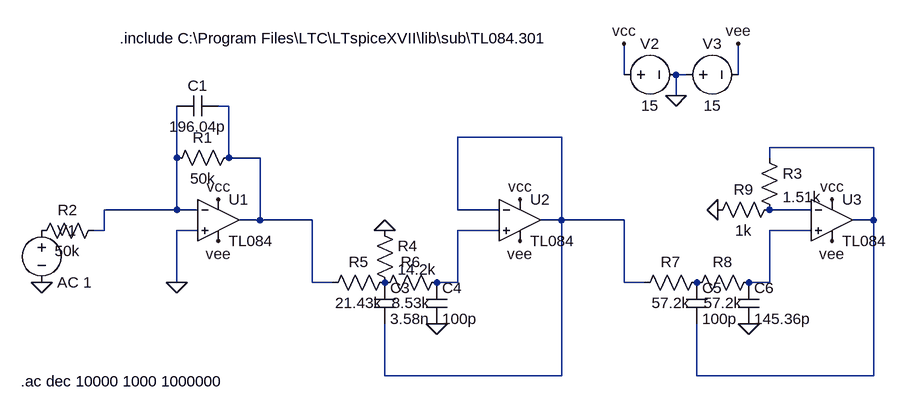
[diagram p0: schematic legendre.asc]
legendre.asc, the LTspice schematic file:
Version 4
SHEET 1 948 680
WIRE 464 -208 464 -256
WIRE 560 -208 544 -208
WIRE 640 -208 640 -256
WIRE 544 -176 544 -208
WIRE -144 -160 -160 -160
WIRE 368 -112 208 -112
WIRE 848 -96 688 -96
WIRE -224 -80 -224 -160
WIRE -144 -80 -144 -160
WIRE -96 -80 -144 -80
WIRE 688 -80 688 -96
WIRE -224 0 -224 -80
WIRE -224 0 -336 0
WIRE -192 0 -224 0
WIRE 208 0 208 -112
WIRE 272 0 208 0
WIRE 752 0 688 0
WIRE -96 16 -96 -80
WIRE -96 16 -128 16
WIRE -16 16 -96 16
WIRE 368 16 368 -112
WIRE 368 16 336 16
WIRE 464 16 368 16
WIRE 848 16 848 -96
WIRE 848 16 816 16
WIRE -336 32 -336 0
WIRE -336 32 -352 32
WIRE -192 32 -224 32
WIRE 272 32 208 32
WIRE 752 32 688 32
WIRE -224 112 -224 32
WIRE -16 112 -16 16
WIRE 16 112 -16 112
WIRE 208 112 208 32
WIRE 208 112 176 112
WIRE 464 112 464 16
WIRE 496 112 464 112
WIRE 688 112 688 32
WIRE 688 112 656 112
WIRE 96 256 96 176
WIRE 368 256 368 16
WIRE 368 256 96 256
WIRE 576 256 576 176
WIRE 848 256 848 16
WIRE 848 256 576 256
FLAG 176 176 0
FLAG 656 176 0
FLAG -224 112 0
FLAG -432 112 0
FLAG 96 32 0
FLAG 608 0 0
FLAG 464 -256 vcc
FLAG 640 -256 vee
FLAG 544 -176 0
FLAG -160 -16 vcc
FLAG 304 -16 vcc
FLAG 784 -16 vcc
FLAG 784 48 vee
FLAG 304 48 vee
FLAG -160 48 vee
SYMBOL res 112 96 R90
WINDOW 0 0 56 VBottom 2
WINDOW 3 32 56 VTop 2
SYMATTR InstName R5
SYMATTR Value 21.43k
SYMBOL cap 80 112 R0
SYMATTR InstName C3
SYMATTR Value 3.58n
SYMBOL res 192 96 R90
WINDOW 0 0 56 VBottom 2
WINDOW 3 32 56 VTop 2
SYMATTR InstName R6
SYMATTR Value 8.53k
SYMBOL cap 160 112 R0
SYMATTR InstName C4
SYMATTR Value 100p
SYMBOL res 592 96 R90
WINDOW 0 0 56 VBottom 2
WINDOW 3 32 56 VTop 2
SYMATTR InstName R7
SYMATTR Value 57.2k
SYMBOL cap 560 112 R0
SYMATTR InstName C5
SYMATTR Value 100p
SYMBOL res 672 96 R90
WINDOW 0 0 56 VBottom 2
WINDOW 3 32 56 VTop 2
SYMATTR InstName R8
SYMATTR Value 57.2k
SYMBOL cap 640 112 R0
SYMATTR InstName C6
SYMATTR Value 145.36p
SYMBOL res -128 -96 R90
WINDOW 0 0 56 VBottom 2
WINDOW 3 32 56 VTop 2
SYMATTR InstName R1
SYMATTR Value 50k
SYMBOL cap -160 -176 R90
WINDOW 0 0 32 VBottom 2
WINDOW 3 32 32 VTop 2
SYMATTR InstName C1
SYMATTR Value 196.04p
SYMBOL res -336 16 R90
WINDOW 0 0 56 VBottom 2
WINDOW 3 32 56 VTop 2
SYMATTR InstName R2
SYMATTR Value 50k
SYMBOL voltage -432 16 R0
WINDOW 123 0 0 Left 0
WINDOW 39 0 0 Left 0
SYMATTR InstName V1
SYMATTR Value AC 1
SYMBOL res 80 16 R0
SYMATTR InstName R4
SYMATTR Value 14.2k
SYMBOL res 672 -96 R0
SYMATTR InstName R3
SYMATTR Value 1.51k
SYMBOL res 704 -16 R90
WINDOW 0 0 56 VBottom 2
WINDOW 3 32 56 VTop 2
SYMATTR InstName R9
SYMATTR Value 1k
SYMBOL Opamps\\opamp2 -160 -48 R0
SYMATTR InstName U1
SYMATTR Value TL084
SYMBOL Opamps\\opamp2 304 -48 R0
SYMATTR InstName U2
SYMATTR Value TL084
SYMBOL Opamps\\opamp2 784 -48 R0
SYMATTR InstName U3
SYMATTR Value TL084
SYMBOL voltage 448 -208 R270
WINDOW 0 32 56 VTop 2
WINDOW 3 -32 56 VBottom 2
WINDOW 123 0 0 Left 0
WINDOW 39 0 0 Left 0
SYMATTR InstName V2
SYMATTR Value 15
SYMBOL voltage 544 -208 R270
WINDOW 0 32 56 VTop 2
WINDOW 3 -32 56 VBottom 2
WINDOW 123 0 0 Left 0
WINDOW 39 0 0 Left 0
SYMATTR InstName V3
SYMATTR Value 15
TEXT -464 264 Left 2 !.ac dec 10000 1000 1000000
TEXT -312 -264 Left 2 !.include C:\\Program Files\\LTC\\LTspiceXVII\\lib\\sub\\TL084.301

The netlist it stands for:
* legendre.asc
R5 P001 N001 21.43k
C3 P001 N002 3.58n
R6 N006 P001 8.53k
C4 N006 0 100p
R7 P002 N002 57.2k
C5 P002 N003 100p
R8 N007 P002 57.2k
C6 N007 0 145.36p
R1 N001 N004 50k
C1 N001 N004 196.04p
R2 N004 P003 50k
V1 P003 0 AC 1
R4 0 P001 14.2k
R3 N003 N005 1.51k
R9 N005 0 1k
XU1 0 N004 vcc vee N001 TL084  ; pins In+ In- V+ V- OUT
XU2 N006 N002 vcc vee N002 TL084  ; pins In+ In- V+ V- OUT
XU3 N007 N005 vcc vee N003 TL084  ; pins In+ In- V+ V- OUT
V2 vcc 0 15
V3 0 vee 15
.ac dec 10000 1000 1000000
.include C:\Program Files\LTC\LTspiceXVII\lib\sub\TL084.301
.backanno
.end